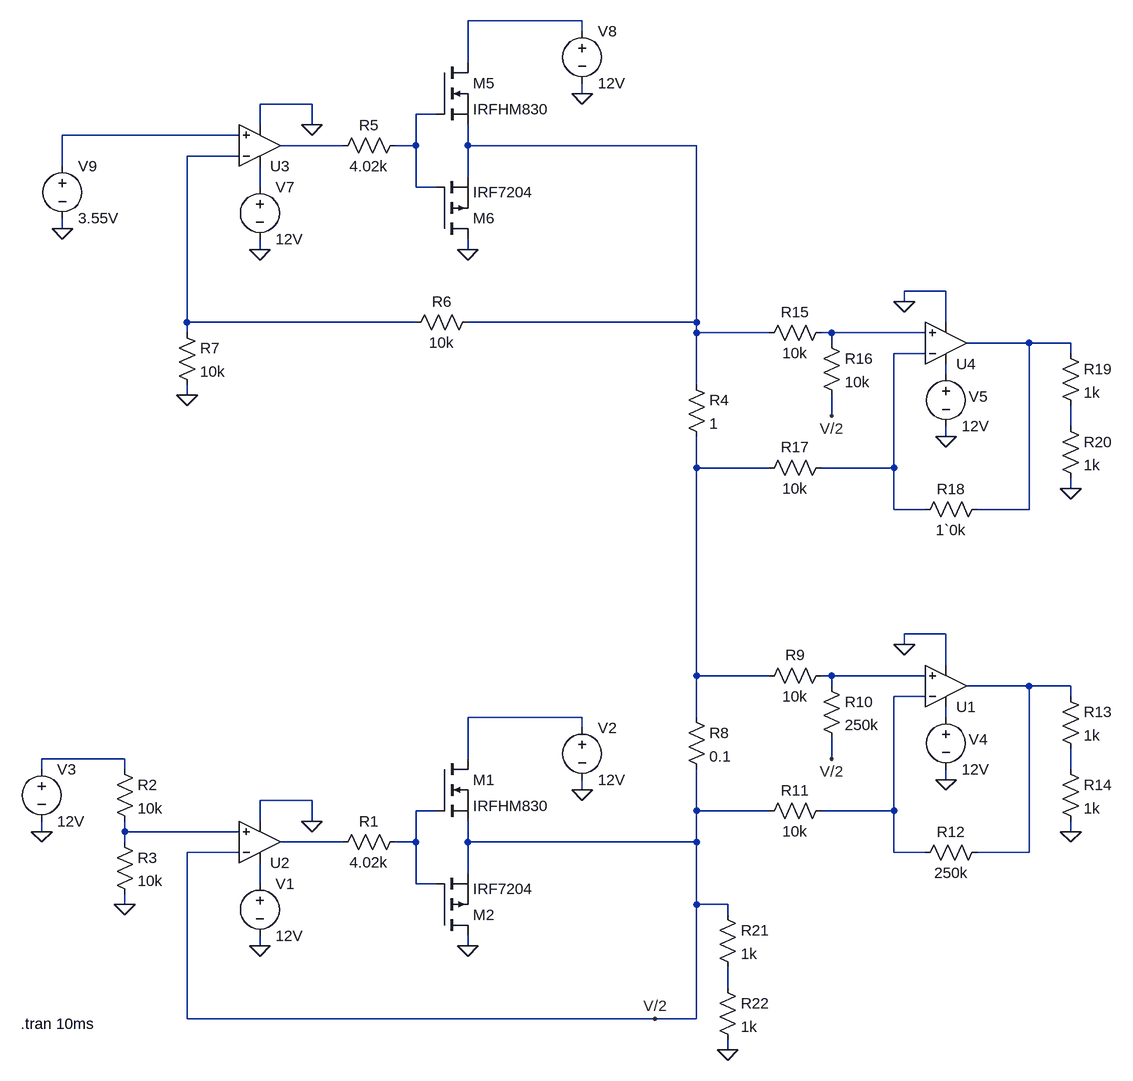
[diagram p0: schematic analog_front_end_sim.asc]
analog_front_end_sim.asc, the LTspice schematic file:
Version 4
SHEET 1 2324 852
WIRE 768 -880 592 -880
WIRE 768 -864 768 -880
WIRE 592 -816 592 -880
WIRE 768 -768 768 -784
WIRE 352 -752 272 -752
WIRE 544 -736 512 -736
WIRE 272 -720 272 -752
WIRE 352 -720 352 -752
WIRE 240 -704 -32 -704
WIRE 400 -688 304 -688
WIRE 512 -688 512 -736
WIRE 512 -688 480 -688
WIRE 592 -688 592 -720
WIRE 944 -688 592 -688
WIRE 240 -672 160 -672
WIRE -32 -656 -32 -704
WIRE 592 -640 592 -688
WIRE 272 -624 272 -656
WIRE 512 -624 512 -688
WIRE 544 -624 512 -624
WIRE -32 -560 -32 -576
WIRE 272 -528 272 -544
WIRE 592 -528 592 -544
WIRE 1328 -464 1264 -464
WIRE 1264 -448 1264 -464
WIRE 160 -416 160 -672
WIRE 512 -416 160 -416
WIRE 944 -416 944 -688
WIRE 944 -416 592 -416
WIRE 1328 -416 1328 -464
WIRE 160 -400 160 -416
WIRE 944 -400 944 -416
WIRE 1056 -400 944 -400
WIRE 1152 -400 1136 -400
WIRE 1296 -400 1152 -400
WIRE 1152 -384 1152 -400
WIRE 1456 -384 1360 -384
WIRE 1520 -384 1456 -384
WIRE 1296 -368 1248 -368
WIRE 1520 -368 1520 -384
WIRE 1328 -336 1328 -352
WIRE 944 -320 944 -400
WIRE 160 -304 160 -320
WIRE 1152 -272 1152 -304
WIRE 1520 -256 1520 -288
WIRE 1328 -240 1328 -256
WIRE 944 -192 944 -240
WIRE 1056 -192 944 -192
WIRE 1248 -192 1248 -368
WIRE 1248 -192 1136 -192
WIRE 1520 -160 1520 -176
WIRE 1248 -128 1248 -192
WIRE 1296 -128 1248 -128
WIRE 1456 -128 1456 -384
WIRE 1456 -128 1376 -128
WIRE 1328 64 1264 64
WIRE 1264 80 1264 64
WIRE 1328 112 1328 64
WIRE 944 128 944 -192
WIRE 1056 128 944 128
WIRE 1152 128 1136 128
WIRE 1296 128 1152 128
WIRE 1152 144 1152 128
WIRE 1456 144 1360 144
WIRE 1520 144 1456 144
WIRE 1296 160 1248 160
WIRE 1520 160 1520 144
WIRE 768 192 592 192
WIRE 944 192 944 128
WIRE 1328 192 1328 176
WIRE 768 208 768 192
WIRE 64 256 -64 256
WIRE 592 256 592 192
WIRE 1152 256 1152 224
WIRE -64 272 -64 256
WIRE 64 272 64 256
WIRE 1520 272 1520 240
WIRE 1328 288 1328 272
WIRE 768 304 768 288
WIRE 352 320 272 320
WIRE 544 336 512 336
WIRE 944 336 944 272
WIRE 1056 336 944 336
WIRE 1248 336 1248 160
WIRE 1248 336 1136 336
WIRE 272 352 272 320
WIRE 352 352 352 320
WIRE -64 368 -64 352
WIRE 64 368 64 352
WIRE 240 368 64 368
WIRE 1520 368 1520 352
WIRE 64 384 64 368
WIRE 400 384 304 384
WIRE 512 384 512 336
WIRE 512 384 480 384
WIRE 592 384 592 352
WIRE 944 384 944 336
WIRE 944 384 592 384
WIRE 240 400 160 400
WIRE 1248 400 1248 336
WIRE 1296 400 1248 400
WIRE 1456 400 1456 144
WIRE 1456 400 1376 400
WIRE 592 432 592 384
WIRE 272 448 272 416
WIRE 512 448 512 384
WIRE 544 448 512 448
WIRE 64 480 64 464
WIRE 944 480 944 384
WIRE 992 480 944 480
WIRE 992 496 992 480
WIRE 272 544 272 528
WIRE 592 544 592 528
WIRE 992 608 992 576
WIRE 160 656 160 400
WIRE 880 656 160 656
WIRE 944 656 944 480
WIRE 944 656 880 656
WIRE 992 704 992 688
FLAG 592 544 0
FLAG 768 304 0
FLAG 272 544 0
FLAG 352 352 0
FLAG 64 480 0
FLAG -64 368 0
FLAG 592 -528 0
FLAG 768 -768 0
FLAG 272 -528 0
FLAG 352 -720 0
FLAG -32 -560 0
FLAG 160 -304 0
FLAG 1328 288 0
FLAG 1264 80 0
FLAG 880 656 V/2
FLAG 1152 256 V/2
FLAG 1520 368 0
FLAG 1328 -240 0
FLAG 1264 -448 0
FLAG 1152 -272 V/2
FLAG 1520 -160 0
FLAG 992 704 0
SYMBOL Opamps\\UniversalOpAmp 272 384 M180
SYMATTR InstName U2
SYMBOL voltage 272 432 R0
SYMATTR InstName V1
SYMATTR Value 12V
SYMBOL res 496 368 R90
WINDOW 0 0 56 VBottom 2
WINDOW 3 32 56 VTop 2
SYMATTR InstName R1
SYMATTR Value 4.02k
SYMBOL nmos 544 256 R0
SYMATTR InstName M1
SYMATTR Value IRFHM830
SYMBOL pmos 544 528 M180
SYMATTR InstName M2
SYMATTR Value IRF7204
SYMBOL voltage 768 192 R0
SYMATTR InstName V2
SYMATTR Value 12V
SYMBOL res 48 256 R0
SYMATTR InstName R2
SYMATTR Value 10k
SYMBOL res 48 368 R0
SYMATTR InstName R3
SYMATTR Value 10k
SYMBOL voltage -64 256 R0
SYMATTR InstName V3
SYMATTR Value 12V
SYMBOL Opamps\\UniversalOpAmp 272 -688 M180
SYMATTR InstName U3
SYMBOL voltage 272 -640 R0
SYMATTR InstName V7
SYMATTR Value 12V
SYMBOL res 496 -704 R90
WINDOW 0 0 56 VBottom 2
WINDOW 3 32 56 VTop 2
SYMATTR InstName R5
SYMATTR Value 4.02k
SYMBOL nmos 544 -816 R0
SYMATTR InstName M5
SYMATTR Value IRFHM830
SYMBOL pmos 544 -544 M180
SYMATTR InstName M6
SYMATTR Value IRF7204
SYMBOL voltage 768 -880 R0
SYMATTR InstName V8
SYMATTR Value 12V
SYMBOL voltage -32 -672 R0
SYMATTR InstName V9
SYMATTR Value 3.55V
SYMBOL res 928 -336 R0
SYMATTR InstName R4
SYMATTR Value 1
SYMBOL res 608 -432 R90
WINDOW 0 0 56 VBottom 2
WINDOW 3 32 56 VTop 2
SYMATTR InstName R6
SYMATTR Value 10k
SYMBOL res 144 -416 R0
SYMATTR InstName R7
SYMATTR Value 10k
SYMBOL res 928 176 R0
SYMATTR InstName R8
SYMATTR Value 0.1
SYMBOL res 1152 112 R90
WINDOW 0 0 56 VBottom 2
WINDOW 3 32 56 VTop 2
SYMATTR InstName R9
SYMATTR Value 10k
SYMBOL res 1136 128 R0
SYMATTR InstName R10
SYMATTR Value 250k
SYMBOL res 1152 320 R90
WINDOW 0 0 56 VBottom 2
WINDOW 3 32 56 VTop 2
SYMATTR InstName R11
SYMATTR Value 10k
SYMBOL Opamps\\UniversalOpAmp 1328 144 M180
SYMATTR InstName U1
SYMBOL voltage 1328 176 R0
WINDOW 0 35 50 Left 2
SYMATTR InstName V4
SYMATTR Value 12V
SYMBOL res 1392 384 R90
WINDOW 0 0 56 VBottom 2
WINDOW 3 32 56 VTop 2
SYMATTR InstName R12
SYMATTR Value 250k
SYMBOL res 1504 144 R0
SYMATTR InstName R13
SYMATTR Value 1k
SYMBOL res 1504 256 R0
SYMATTR InstName R14
SYMATTR Value 1k
SYMBOL res 1152 -416 R90
WINDOW 0 0 56 VBottom 2
WINDOW 3 32 56 VTop 2
SYMATTR InstName R15
SYMATTR Value 10k
SYMBOL res 1136 -400 R0
SYMATTR InstName R16
SYMATTR Value 10k
SYMBOL res 1152 -208 R90
WINDOW 0 0 56 VBottom 2
WINDOW 3 32 56 VTop 2
SYMATTR InstName R17
SYMATTR Value 10k
SYMBOL Opamps\\UniversalOpAmp 1328 -384 M180
SYMATTR InstName U4
SYMBOL voltage 1328 -352 R0
WINDOW 0 35 50 Left 2
SYMATTR InstName V5
SYMATTR Value 12V
SYMBOL res 1392 -144 R90
WINDOW 0 0 56 VBottom 2
WINDOW 3 32 56 VTop 2
SYMATTR InstName R18
SYMATTR Value 1`0k
SYMBOL res 1504 -384 R0
SYMATTR InstName R19
SYMATTR Value 1k
SYMBOL res 1504 -272 R0
SYMATTR InstName R20
SYMATTR Value 1k
SYMBOL res 976 480 R0
SYMATTR InstName R21
SYMATTR Value 1k
SYMBOL res 976 592 R0
SYMATTR InstName R22
SYMATTR Value 1k
TEXT -96 664 Left 2 !.tran 10ms

The netlist it stands for:
* analog_front_end_sim.asc
XU2 N022 V/2 N024 0 N023 level1 Avol=1Meg GBW=10Meg Vos=0 En=0 Enk=0 In=0 Ink=0 Rin=500Meg  ; pins In+ In- V+ V- OUT
V1 N024 0 12V
R1 N021 N023 4.02k
M1 N017 N021 V/2 V/2 IRFHM830
M2 0 N021 V/2 V/2 IRF7204
V2 N017 0 12V
R2 N019 N022 10k
R3 N022 0 10k
V3 N019 0 12V
XU3 N003 N006 N007 0 N004 level1 Avol=1Meg GBW=10Meg Vos=0 En=0 Enk=0 In=0 Ink=0 Rin=500Meg  ; pins In+ In- V+ V- OUT
V7 N007 0 12V
R5 N002 N004 4.02k
M5 N001 N002 N005 N005 IRFHM830
M6 0 N002 N005 N005 IRF7204
V8 N001 0 12V
V9 N003 0 3.55V
R4 N005 N013 1
R6 N005 N006 10k
R7 N006 0 10k
R8 N013 V/2 0.1
R9 N014 N013 10k
R10 N014 V/2 250k
R11 N016 V/2 10k
XU1 N014 N016 N018 0 N015 level1 Avol=1Meg GBW=10Meg Vos=0 En=0 Enk=0 In=0 Ink=0 Rin=500Meg  ; pins In+ In- V+ V- OUT
V4 N018 0 12V
R12 N015 N016 250k
R13 N015 N020 1k
R14 N020 0 1k
R15 N008 N005 10k
R16 N008 V/2 10k
R17 N010 N013 10k
XU4 N008 N010 N011 0 N009 level1 Avol=1Meg GBW=10Meg Vos=0 En=0 Enk=0 In=0 Ink=0 Rin=500Meg  ; pins In+ In- V+ V- OUT
V5 N011 0 12V
R18 N009 N010 1`0k
R19 N009 N012 1k
R20 N012 0 1k
R21 V/2 N025 1k
R22 N025 0 1k
.model NMOS NMOS
.model PMOS PMOS
.lib standard.mos
.tran 10ms
.lib UniversalOpAmp1.lib
.backanno
.end